# Altium schematic sheet Remote Controller.SchDoc
size B
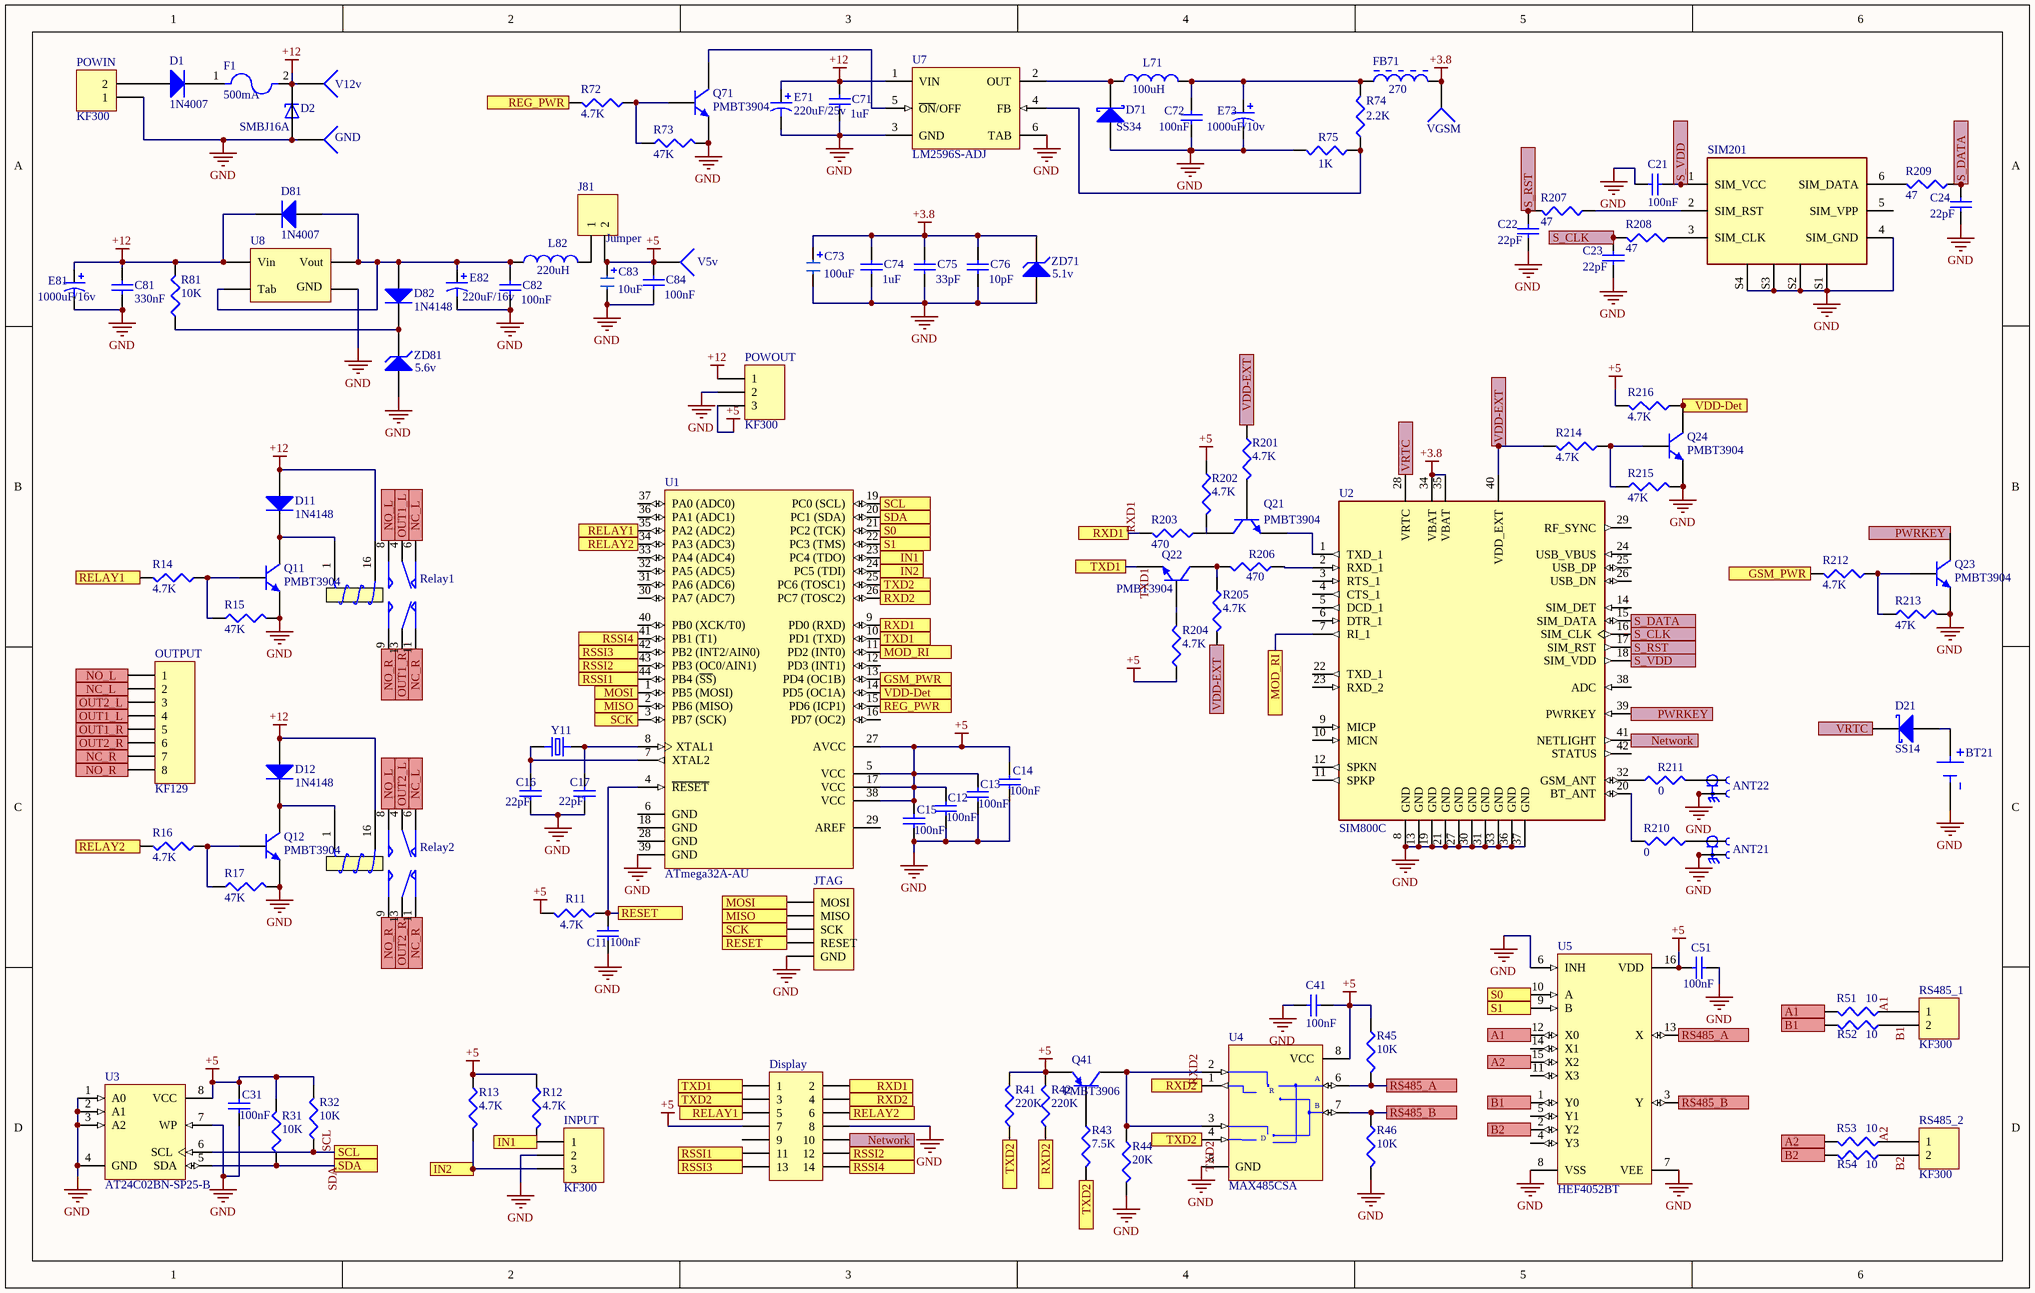
[diagram p0: Remote Controller.SchDoc]

## Parts
ANT21  PIFA_ANTENNA  [PIFA_CONNECTOR]  (value not drawn)
ANT22  SMA_CONNECTOR  [LPRS_SMA_CONNECTOR]  (value not drawn)
BT21  BH32T-C  [BAT_BH32T-C]  (value not drawn)
C11  value 100nF  [C0805]  (hidden comment: Cap)
C12  value 100nF  [C0805]  (hidden comment: Cap)
C13  value 100nF  [C0805]  (hidden comment: Cap)
C14  value 100nF  [C0805]  (hidden comment: Cap)
C15  value 100nF  [C0805]  (hidden comment: Cap)
C16  value 22pF  [C0805]  (hidden comment: Cap)
C17  value 22pF  [C0805]  (hidden comment: Cap)
C21  value 100nF  [C0805]  (hidden comment: Cap)
C22  value 22pF  [C0805]  (hidden comment: Cap)
C23  value 22pF  [C0805]  (hidden comment: Cap)
C24  value 22pF  [C0805]  (hidden comment: Cap)
C31  value 100nF  [C0805]  (hidden comment: Cap)
C41  value 100nF  [C0805]  (hidden comment: Cap)
C51  value 100nF  [C0805]  (hidden comment: Cap)
C71  value 1uF  [C1206]  (hidden comment: Cap)
C72  value 100nF  [C0805]  (hidden comment: Cap)
C73  value 100uF  [Tantalium CASE B]  (hidden comment: Tantalium Cap)
C74  value 1uF  [C1206]  (hidden comment: Cap)
C75  value 33pF  [C0805]  (hidden comment: Cap)
C76  value 10pF  [C0805]  (hidden comment: Cap)
C81  value 330nF  [C0805]  (hidden comment: Cap)
C82  value 100nF  [C0805]  (hidden comment: Cap)
C83  value 10uF  [Tantalium CASE A]  (hidden comment: Tantalium Cap)
C84  value 100nF  [C0805]  (hidden comment: Cap)
D1  1N4007  [DO-214AC(SMA)]
D2  SMBJ16A  [DIOM4336X265N]
D11  1N4148  [Mini MELF]
D12  1N4148  [Mini MELF]
D21  SS14  [DO-214AC(SMA)]
D71  SS34  [DO-214AC(SMA)]
D81  1N4007  [DO-214AC(SMA)]
D82  1N4148  [Mini MELF]
Display  Header 7X2  [HDR2X7]  (value not drawn)
E71  value 220uF/25v  [E]  (hidden comment: 94SS227X06R3EBP)
E73  value 1000uF/10v  [E]  (hidden comment: 94SA107X0016EBP)
E81  value 1000uF/16v  [E]  (hidden comment: 94SA107X0016EBP)
E82  value 220uF/16v  [D]  (hidden comment: 94SC226X0016DBP)
F1  value 500mA  [FUSE SMD 2410]  (hidden comment: Fuse SMD)
FB71  value 270  [AXIAL-0.3]  (hidden comment: Ferrite Bead)
GND  Socket  [PIN1]  (value not drawn)
INPUT  KF300  [HDR1X3]
J81  Jumper  [HDR1X2]
JTAG  Right Female Header 5-Pin  [HDR1X5]  (value not drawn)
L71  value 100uH  [IND POWER RH74]  (hidden comment: Inductor)
L82  value 220uH  [IND POWER CD54]  (hidden comment: Inductor)
OUTPUT  KF129  [HDR1X8]
POWIN  KF300  [HDR1X2]
POWOUT  KF300  [HDR1X3]
Q11  PMBT3904  [SOT-23A_N]
Q12  PMBT3904  [SOT-23A_N]
Q21  PMBT3904  [SOT-23A_N]
Q22  PMBT3904  [SOT-23A_N]
Q23  PMBT3904  [SOT-23A_N]
Q24  PMBT3904  [SOT-23A_N]
Q41  PMBT3906  [SOT-23A_N]
Q71  PMBT3904  [SOT-23A_N]
R11  value 4.7K  [R0805]  (hidden comment: Res)
R12  value 4.7K  [R0805]  (hidden comment: Res)
R13  value 4.7K  [R0805]  (hidden comment: Res)
R14  value 4.7K  [R0805]  (hidden comment: Res)
R15  value 47K  [R0805]  (hidden comment: Res)
R16  value 4.7K  [R0805]  (hidden comment: Res)
R17  value 47K  [R0805]  (hidden comment: Res)
R31  value 10K  [R0805]  (hidden comment: Res)
R32  value 10K  [R0805]  (hidden comment: Res)
R41  value 220K  [R0805]  (hidden comment: Res)
R42  value 220K  [R0805]  (hidden comment: Res)
R43  value 7.5K  [R0805]  (hidden comment: Res)
R44  value 20K  [R0805]  (hidden comment: Res)
R45  value 10K  [R0805]  (hidden comment: Res)
R46  value 10K  [R0805]  (hidden comment: Res)
R51  value 10  [R0805]  (hidden comment: Res)
R52  value 10  [R0805]  (hidden comment: Res)
R53  value 10  [R0805]  (hidden comment: Res)
R54  value 10  [R0805]  (hidden comment: Res)
R72  value 4.7K  [R0805]  (hidden comment: Res)
R73  value 47K  [R0805]  (hidden comment: Res)
R74  value 2.2K  [R0805]  (hidden comment: Res)
R75  value 1K  [R0805]  (hidden comment: Res)
R81  value 10K  [R0805]  (hidden comment: Res)
R201  value 4.7K  [R0805]  (hidden comment: Res)
R202  value 4.7K  [R0805]  (hidden comment: Res)
R203  value 470  [R0805]  (hidden comment: Res)
R204  value 4.7K  [R0805]  (hidden comment: Res)
R205  value 4.7K  [R0805]  (hidden comment: Res)
R206  value 470  [R0805]  (hidden comment: Res)
R207  value 47  [R0805]  (hidden comment: Res)
R208  value 47  [R0805]  (hidden comment: Res)
R209  value 47  [R0805]  (hidden comment: Res)
R210  value 0  [R0805]  (hidden comment: Res)
R211  value 0  [R0805]  (hidden comment: Res)
R212  value 4.7K  [R0805]  (hidden comment: Res)
R213  value 47K  [R0805]  (hidden comment: Res)
R214  value 4.7K  [R0805]  (hidden comment: Res)
R215  value 47K  [R0805]  (hidden comment: Res)
R216  value 4.7K  [R0805]  (hidden comment: Res)
Relay1  2C Relay 12V  [Relay v23105-a5001-a201]  (value not drawn)
Relay2  2C Relay 12V  [Relay v23105-a5001-a201]  (value not drawn)
RS485_1  KF300  [HDR1X2]
RS485_2  KF300  [HDR1X2]
SIM201  SIM Card Holder 6PIN  [SIM Card Holder]  (value not drawn)
U1  ATmega32A-AU  [44A_N]
U2  SIM800C  [LCC110P1570X1760X250-42N]
U3  AT24C02BN-SP25-B  [8S1_N]
U4  MAX485CSA  [NSO8_N]
U5  HEF4052BT  [751B-05_N]
U7  LM2596S-ADJ  [TS5B_N]
U8  Volt Reg  [SOT223_N]  (value not drawn)
V5v  Socket  [PIN1]  (value not drawn)
V12v  Socket  [PIN1]  (value not drawn)
VGSM  Socket  [PIN1]  (value not drawn)
Y11  Crystal Oscillator  [XTAL THD]  (value not drawn)
ZD71  value 5.1v  [Mini MELF]  (hidden comment: Diode Zener)
ZD81  value 5.6v  [Mini MELF]  (hidden comment: Diode Zener)

## Ports
A1, A2, B1, B2, GSM_PWR, IN1, IN2, MISO, MOD_RI, MOSI, NC_L, NC_R, Network, NO_L, NO_R, OUT1_L, OUT1_R, OUT2_L, OUT2_R, PWRKEY, REG_PWR, RELAY1, RELAY2, RESET, RS485_A, RS485_B, RSSI1, RSSI2, RSSI3, RSSI4, RXD1, RXD2, S0, S1, S_CLK, S_DATA, S_RST, S_VDD, SCK, SCL, SDA, TXD1, TXD2, VDD-Det, VDD-EXT, VRTC

## Nets
+3.8: C73.1 C74.2 C75.2 C76.2 FB71.2 U2.34(VBAT) U2.35(VBAT) VGSM.1 ZD71.2(K)
+5: C12.1 C13.1 C14.1 C15.1 C31.1 C41.2 C51.1 C83.1 C84.2 Display.7 J81.2 POWOUT.3 Q41.2(E) R11.2 R12.1 R13.1 R31.2 R32.2 R41.2 R42.2 R45.1 R202.1 R204.1 R216.2 U1.5(VCC) U1.17(VCC) U1.27(AVCC) U1.38(VCC) U3.8(VCC) U4.8(VCC) U5.16(VDD) V5v.1
+12: C71.2 C81.2 D2.C D11.1(A) D12.1(A) D81.2(K) E71.1 E81.1 F1.2 POWOUT.1 R81.2 Relay1.16(T1) Relay2.16(T1) U7.1(VIN) U8.3(Vin) V12v.1
GND: ANT21.G1 ANT21.G2 ANT22.G1 ANT22.G2 ANT22.G3 ANT22.G4 BT21.NEG C11.2 C12.2 C13.2 C14.2 C15.2 C16.2 C17.2 C21.2 C22.2 C23.2 C24.2 C31.2 C41.1 C51.2 C71.1 C72.1 C73.2 C74.1 C75.1 C76.1 C81.1 C82.1 C83.2 C84.1 D2.A D71.1(A) Display.8 E71.2 E73.2 E81.2 E82.2 GND.1 INPUT.2 JTAG.5(GND) POWIN.1 POWOUT.2 Q11.2(E) Q12.2(E) Q23.2(E) Q24.2(E) Q71.2(E) R15.2 R17.2 R44.2 R46.2 R73.2 R75.2 R213.2 R215.2 SIM201.4(SIM_GND) SIM201.S1 SIM201.S2 SIM201.S3 SIM201.S4 U1.39(GND) U2.8(GND) U2.13(GND) U2.19(GND) U2.21(GND) U2.27(GND) U2.30(GND) U2.31(GND) U2.33(GND) U2.36(GND) U2.37(GND) U3.1(A0) U3.2(A1) U3.3(A2) U3.4(GND) U3.7(WP) U4.5(GND) U5.6(INH) U5.7(VEE) U5.8(VSS) U7.3(GND) U7.6(TAB) U8.1(GND) ZD71.1(A) ZD81.1(A)
A1: R51.2 U5.12(X0) ; port A1
A1: R51.1 RS485_1.1  [a separate net that carries the same name]
A2: R53.2 U5.15(X2) ; port A2
A2: R53.1 RS485_2.1  [a separate net that carries the same name]
B1: R52.2 U5.1(Y0) ; port B1
B1: R52.1 RS485_1.2  [a separate net that carries the same name]
B2: R54.2 U5.2(Y2) ; port B2
B2: R54.1 RS485_2.2  [a separate net that carries the same name]
GSM_PWR: R212.2 U1.13(PD4_(OC1B)) ; port GSM_PWR
IN1: INPUT.1 R12.2 U1.23(PC4_(TDO)) ; port IN1
IN2: INPUT.3 R13.2 U1.24(PC5_(TDI)) ; port IN2
MISO: JTAG.2(MISO) U1.2(PB6_(MISO)) ; port MISO
MOD_RI: U1.11(PD2_(INT0)) U2.7(RI_1) ; port MOD_RI
MOSI: JTAG.1(MOSI) U1.1(PB5_(MOSI)) ; port MOSI
NC_L: OUTPUT.2 Relay1.6(NC) Relay2.6(NC) ; port NC_L
NC_R: OUTPUT.7 Relay1.11(NC) Relay2.11(NC) ; port NC_R
Network: Display.10 U2.41(NETLIGHT) ; port Network
NO_L: OUTPUT.1 Relay1.8(NO) Relay2.8(NO) ; port NO_L
NO_R: OUTPUT.8 Relay1.9(NO) Relay2.9(NO) ; port NO_R
OUT1_L: OUTPUT.4 Relay1.4(COM) ; port OUT1_L
OUT1_R: OUTPUT.5 Relay1.13(COM) ; port OUT1_R
OUT2_L: OUTPUT.3 Relay2.4(COM) ; port OUT2_L
OUT2_R: OUTPUT.6 Relay2.13(COM) ; port OUT2_R
PWRKEY: Q23.3(C) U2.39(PWRKEY) ; port PWRKEY
REG_PWR: R72.2 U1.15(PD6_(ICP1)) ; port REG_PWR
RELAY1: Display.5 R14.2 U1.35(PA2_(ADC2)) ; port RELAY1
RELAY2: Display.6 R16.2 U1.34(PA3_(ADC3)) ; port RELAY2
RESET: C11.1 JTAG.4(RESET) R11.1 U1.4(~{RESET}) ; port RESET
RS485_A: R45.2 U4.6(A) U5.13(X) ; port RS485_A
RS485_B: R46.1 U4.7(B) U5.3(Y) ; port RS485_B
RSSI1: Display.11 U1.44(PB4_(~{SS})) ; port RSSI1
RSSI2: Display.12 U1.43(PB3_(OC0/AIN1)) ; port RSSI2
RSSI3: Display.13 U1.42(PB2_(INT2/AIN0)) ; port RSSI3
RSSI4: Display.14 U1.41(PB1_(T1)) ; port RSSI4
RXD1: Display.2 R203.2 U1.9(PD0_(RXD)) ; port RXD1
RXD2: Display.4 R42.1 U1.26(PC7_(TOSC2)) U4.1(RO) ; port RXD2
S0: U1.21(PC2_(TCK)) U5.10(A) ; port S0
S1: U1.22(PC3_(TMS)) U5.9(B) ; port S1
S_CLK: C23.1 R208.2 U2.16(SIM_CLK) ; port S_CLK
S_DATA: C24.1 R209.1 U2.15(SIM_DATA) ; port S_DATA
S_RST: C22.1 R207.2 U2.17(SIM_RST) ; port S_RST
S_VDD: C21.1 SIM201.1(SIM_VCC) U2.18(SIM_VDD) ; port S_VDD
SCK: JTAG.3(SCK) U1.3(PB7_(SCK)) ; port SCK
SCL: R32.1 U1.19(PC0_(SCL)) U3.6(SCL) ; port SCL
SDA: R31.1 U1.20(PC1_(SDA)) U3.5(SDA) ; port SDA
TXD1: Display.1 Q22.2(E) U1.10(PD1_(TXD)) ; port TXD1
TXD2: Display.3 R41.1 R43.2 U1.25(PC6_(TOSC1)) U4.4(DI) ; port TXD2
VDD-Det: Q24.3(C) R216.1 U1.14(PD5_(OC1A)) ; port VDD-Det
VDD-EXT: R201.1 R205.2 R214.2 U2.40(VDD_EXT) ; port VDD-EXT
VRTC: D21.2(K) U2.28(VRTC) ; port VRTC
NetANT21_1: ANT21.1 R210.1
NetANT22_1: ANT22.1 R211.2
NetBT21_POS: BT21.POS D21.1(A)
NetC16_1: C16.1 U1.7(XTAL2) Y11.1
NetC17_1: C17.1 U1.8(XTAL1) Y11.2
NetC72_2: C72.2 E73.1 FB71.1 L71.2 R74.2
NetC82_2: C82.2 D81.1(A) D82.1(A) E82.1 L82.1 U8.2(Vout) U8.4(Tab)
NetD1_1: D1.1(A) POWIN.2
NetD1_2: D1.2(K) F1.1
NetD11_2: D11.2(K) Q11.3(C) Relay1.1(T2)
NetD12_2: D12.2(K) Q12.3(C) Relay2.1(T2)
NetD71_2: D71.2(K) L71.1 U7.2(OUT)
NetD82_2: D82.2(K) R81.1 ZD81.2(K)
NetJ81_1: J81.1 L82.2
NetQ11_1: Q11.1(B) R14.1 R15.1
NetQ12_1: Q12.1(B) R16.1 R17.1
NetQ21_1: Q21.1(B) R201.2
NetQ21_2: Q21.2(E) U2.1(TXD_1)
NetQ21_3: Q21.3(C) R202.2 R203.1
NetQ22_1: Q22.1(B) R204.2
NetQ22_3: Q22.3(C) R205.1 R206.2
NetQ23_1: Q23.1(B) R212.1 R213.1
NetQ24_1: Q24.1(B) R214.1 R215.1
NetQ41_1: Q41.1(B) R43.1
NetQ41_3: Q41.3(C) R44.1 U4.2(~{RE}) U4.3(DE)
NetQ71_1: Q71.1(B) R72.1 R73.1
NetQ71_3: Q71.3(C) U7.5(~{ON}/OFF)
NetR74_1: R74.1 R75.1 U7.4(FB)
NetR206_1: R206.1 U2.2(RXD_1)
NetR207_1: R207.1 SIM201.2(SIM_RST)
NetR208_1: R208.1 SIM201.3(SIM_CLK)
NetR209_2: R209.2 SIM201.6(SIM_DATA)
NetR210_2: R210.2 U2.20(BT_ANT)
NetR211_1: R211.1 U2.32(GSM_ANT)

Not connected (* = marked no-connect by the designer): Display 9; SIM201 5(SIM_VPP); U1 6(GND) 12(PD3_(INT1)) 16(PD7_(OC2)) 18(GND) 28(GND) 29(AREF) 30(PA7_(ADC7)) 31(PA6_(ADC6)) 32(PA5_(ADC5)) 33(PA4_(ADC4)) 36(PA1_(ADC1)) 37(PA0_(ADC0)) 40(PB0_(XCK/T0)); U2 3(RTS_1) 4(CTS_1) 5(DCD_1) 6(DTR_1) 9(MICP) 10(MICN) 11(SPKP) 12(SPKN) 14(SIM_DET) 22(TXD_1) 23(RXD_2) 24(USB_VBUS) 25(USB_DP) 26(USB_DN) 29(RF_SYNC) 38(ADC) 42(STATUS); U5 4(Y3) 5(Y1) 11(X3) 14(X1)

## Notes on the sheet
- (in symbol MAX485CSA) R; D

## Library data of the parts
ANT21 = PIFA_ANTENNA: RF Connectors / Printed and Surface-mount Antenna; MP: SMA CONNECTOR; MF: LPRS; Check_prices: https://www.snapeda.com/parts/SMA%20CONNECTOR/LPRS/view-part/?ref=eda; Value: *; Availability: In Stock; Price: None; Package: None; SnapEDA_Link: https://www.snapeda.com/parts/SMA%20CONNECTOR/LPRS/view-part/?ref=snap; Purchase-URL: https://pricing.snapeda.com/search/part/SMA CONNECTOR/?ref=eda
ANT22 = SMA_CONNECTOR: RF Connectors / Coaxial Connectors SMA Coaxial Right angled; MP: SMA CONNECTOR; MF: LPRS; Check_prices: https://www.snapeda.com/parts/SMA%20CONNECTOR/LPRS/view-part/?ref=eda; Value: *; Availability: In Stock; Price: None; Package: None; SnapEDA_Link: https://www.snapeda.com/parts/SMA%20CONNECTOR/LPRS/view-part/?ref=snap; Purchase-URL: https://pricing.snapeda.com/search/part/SMA CONNECTOR/?ref=eda
BT21 = BH32T-C: BATTERY HOLDER COIN 20MM PC PIN; MF: MPD; SnapEDA_Link: https://www.snapeda.com/parts/BH32T-C/Memory+Protection+Devices/view-part/?ref=snap; Package: None; MP: BH32T-C; Check_prices: https://www.snapeda.com/parts/BH32T-C/Memory+Protection+Devices/view-part/?ref=eda; Purchase-URL: https://pricing.snapeda.com/search/part/BH32T-C/?ref=eda; Price: None; Value: *; Availability: In Stock
C11-C17 C21-C24 C31 C41 C51 C71 C72 C74-C76 C81 C82 C84 = Cap: Capacitor
C73 C83 = Cap Pol2: Polarized Capacitor Tantalium
D1 D81 = Diode: Default Diode; Published: 8-Jun-2000; LatestRevisionDate: 17-Jul-2002; LatestRevisionNote: Re-released for DXP Platform.; PackageVersion: Sep-1996; PackageReference: SMC; Publisher: Altium Limited; PackageDescription: DO-214-AB/SMC; 2 C-Bend Leads; Body 7.9 x 5.9 mm, inc. leads (LxW); Code_JEDEC: DO-214-AB; value: 1N4007
D2 = SMBJ12A: 15.6V Clamp 17.5A Ipp Tvs Diode Surface Mount DO-214AA (SMB); MF: ON Semiconductor; Purchase-URL: https://pricing.snapeda.com/search/part/SMBJ12A/?ref=eda; MP: SMBJ12A; SnapEDA_Link: https://www.snapeda.com/parts/SMBJ12A/Onsemi/view-part/?ref=snap; Price: None; Package: SMB-2 Fairchild Semiconductor; Check_prices: https://www.snapeda.com/parts/SMBJ12A/Onsemi/view-part/?ref=eda; Value: *; Availability: In Stock
D11 D12 D82 = Diode 1N4148: High Conductance Fast Diode; PackageDescription: Diode
D21 = 1N6095: Schottky Rectifier; Note: No PCB Footprint Available; Published: 8-Jun-2000; LatestRevisionDate: 17-Jul-2002; LatestRevisionNote: Re-released for DXP Platform.; DatasheetVersion: Dec-1997; PackageReference: DO-203AA; Publisher: Altium Limited; ComponentLink1Description: Manufacturer Link; ComponentLink1URL: http://www.irf.com/; ComponentLink2Description: Datasheet; ComponentLink2URL: http://www.irf.com/product-info/datasheets/data/1n6096.pdf; value: SS14
D71 = SS36: Schottky Rectifier; PackageDescription: DO-214-AB/SMC; 2 C-Bend Leads; Body 7.9 x 5.9 mm, inc. leads (LxW); value: SS34
Display = Header 7X2: Header, 7-Pin, Dual row; value: IDC Box; LatestRevisionDate: 17-Jul-2002; LatestRevisionNote: Re-released for DXP Platform.; Publisher: Altium Limited
E71 = 94SS227X06R3EBP: Solid Aluminum Capacitor with Organic Semiconductor Electrolyte: 220uF, 6.3V, Bulk Pack; Note: Part Numbers shown are for ± 20% capacitance tolerance (X0).; PCB_Layout: Complies with Manufacturer's Recommendation.; DrillSize: Nominal, Rounded to the nearest 0.1mm; Published: 19-Mar-2004; DatasheetDocument: 23-May-2001; PackageReference: E; Publisher: Altium Limited; ComponentLink1Description: Manufacturer Link; ComponentLink1URL: http://www.vishay.com/; ComponentLink2Description: Datasheet; ComponentLink2URL: http://www.vishay.com/docs/90008/94ss.pdf
E73 E81 = 94SA107X0016EBP: Solid Aluminum Capacitor with Organic Semiconductor Electrolyte: 100uF, 16V, Bulk Pack; Note: Part Numbers shown are for ± 20% capacitance tolerance (X0).; PCB_Layout: Complies with Manufacturer's Recommendation.; DrillSize: Nominal, Rounded to the nearest 0.1mm; Published: 19-Mar-2004; DatasheetDocument: 29-Jun-2001; PackageReference: E; Publisher: Altium Limited; ComponentLink1Description: Manufacturer Link; ComponentLink1URL: http://www.vishay.com/; ComponentLink2Description: Datasheet; ComponentLink2URL: http://www.vishay.com/docs/90003/94sa.pdf
E82 = 94SC226X0016DBP: Solid Aluminum Capacitor with Organic Semiconductor Electrolyte: 22uF, 16V, Bulk Pack; Note: Part Numbers shown are for ± 20% capacitance tolerance (X0).; PCB_Layout: Complies with Manufacturer's Recommendation.; DrillSize: Nominal, Rounded to the nearest 0.1mm; Published: 19-Mar-2004; DatasheetDocument: 23-May-2001; PackageReference: D; Publisher: Altium Limited; ComponentLink1Description: Manufacturer Link; ComponentLink1URL: http://www.vishay.com/; ComponentLink2Description: Datasheet; ComponentLink2URL: http://www.vishay.com/docs/90004/94sc.pdf
F1 = Fuse SMD: 2410 SMT Fuse | Quick Acting | 1A; MF: Bel Fuse; MP: 0679L1000-05; SnapEDA_Link: https://www.snapeda.com/parts/0679L1000-05/Bel%20Fuse/view-part/1313867/?ref=snap; Availability: Warning; Price: None; Package: SMD-2 Bel Fuse; Purchase-URL: https://pricing.snapeda.com/search/part/0679L1000-05/?ref=eda
INPUT POWOUT = Header 3: Header, 3-Pin; value: KF300-3P; LatestRevisionDate: 17-Jul-2002; LatestRevisionNote: Re-released for DXP Platform.; Publisher: Altium Limited
J81 = Header 2: Header, 2-Pin; LatestRevisionDate: 17-Jul-2002; LatestRevisionNote: Re-released for DXP Platform.; Publisher: Altium Limited
JTAG = Header 5: Header, 5-Pin; LatestRevisionDate: 17-Jul-2002; LatestRevisionNote: Re-released for DXP Platform.; Publisher: Altium Limited
L71 L82 = Inductor: Inductor SMD; PackageDescription: Inductor
OUTPUT = Header 8: Header, 8-Pin; LatestRevisionDate: 17-Jul-2002; LatestRevisionNote: Re-released for DXP Platform.; Publisher: Altium Limited; value: KF129
POWIN RS485_1 RS485_2 = Header 2: Header, 2-Pin; value: KF300-2P; LatestRevisionDate: 17-Jul-2002; LatestRevisionNote: Re-released for DXP Platform.; Publisher: Altium Limited
Q11 Q12 Q21-Q24 Q71 = BC817-25: NPN General Purpose Amplifier; Published: 8-Jun-2000; LatestRevisionDate: 20-Nov-2009; LatestRevisionNote: IPC-7351 Footprint Added.; DatasheetVersion: 1997; PackageVersion: Sep-1998; PackageReference: SOT-23A; Publisher: Altium Limited; PackageDescription: 3-Pin SOT-23 Package 0.95 mm Pitch, 2.3 mm Lead Span; ComponentLink1Description: Manufacturer Link; ComponentLink1URL: http://www.fairchildsemi.com/; ComponentLink2Description: Discontinuation Notice; ComponentLink2URL: http://www.fairchildsemi.com/obsolete/obs.jsp
Q41 = BC807-25: PNP General Purpose Amplifier; Published: 8-Jun-2000; LatestRevisionDate: 20-Nov-2009; LatestRevisionNote: IPC-7351 Footprint Added.; DatasheetVersion: 1997; PackageVersion: Sep-1998; PackageReference: SOT-23A; Publisher: Altium Limited; PackageDescription: 3-Pin SOT-23 Package 0.95 mm Pitch, 2.3 mm Lead Span; ComponentLink1Description: Manufacturer Link; ComponentLink1URL: http://www.fairchildsemi.com/; ComponentLink2Description: Datasheet; ComponentLink2URL: http://www.fairchildsemi.com/ds/BC%2FBC807.pdf
R11-R17 R31 R32 R41-R46 R51-R54 R72-R75 R81 R201-R216 = Res: Resistor; PackageDescription: Chip Resistor
Relay1 Relay2 = Relay-8Pin: 2C Telecommunication Relay
SIM201 = SIM Card Holder 6PIN: 6 Position Card Connector SIM Card Surface Mount, Right Angle Gold; MP: 693010020611; MF: Wurth Electronics; Price: None; SnapEDA_Link: https://www.snapeda.com/parts/693010020611/Wurth%20Electronics%20Inc./view-part/514470/?ref=snap; Package: None; Value: *; Availability: Unavailable
U1 = ATmega32A-AU: 8-bit AVR Microcontroller, 2.7-5.5V, 16MHz, 32KB Flash, 1KB EEPROM, 2KB SRAM, 44-pin TQFP, Industrial Grade (-40°C to 85°C); DatasheetVersion: revC, Feb-2011; PackageVersion: revC, Oct-2010; PackageReference: 44A; PackageDescription: 44-Pin Plastic Thin Profile Quad Flat Pack, 10 x 10 x 1.0 mm Body, 0.8 mm Pitch (TQFP); Code_JEDEC: MS-026-ACB; ComponentLink1Description: Manufacturer URL; ComponentLink1URL: http://www.atmel.com/; ComponentLink2Description: ATmega32A Datasheet; ComponentLink2URL: http://www.atmel.com/dyn/resources/prod_documents/doc8155.pdf; ComponentLink3Description: ATmega32A Summary; ComponentLink3URL: http://www.atmel.com/dyn/resources/prod_documents/8155S.pdf
U2 = SIM800C: Module: GSM/Bluetooth; GPRS; 2G; 1800MHz, 900MHz; 85.6kbps; SMD; MF: Simcom; MP: SIM800C; Availability: Unavailable; Package: None; Value: *; Price: None; SnapEDA_Link: https://www.snapeda.com/parts/SIM800C/SIMcom%20Wireless%20solutions%20Co.%2CLtd/view-part/571323/?ref=snap
U3 = AT24C02BN-SP25-B: 2Kbit (256 x 8), 2-wire Bus Automotive Serial EEPROM with full memory Write Protect, 2.5V, 8-Pin SOIC, Bulk; Published: 20-Sep-2010; DatasheetVersion: 8517C,  Jan-2009; PackageVersion: revC, Mar-2005; PackageReference: 8S1; Publisher: Altium Limited; PackageDescription: 8-Lead (0.150" Wide Body), Plastic Gull Wing Small Outline (JEDEC SOIC); Code_JEDEC: MS-012-AA; Code_IPC: SOIC127P600-8; ComponentLink1Description: Manufacturer Link; ComponentLink1URL: http://www.atmel.com/products/serial/default.asp; ComponentLink2Description: Datasheet; ComponentLink2URL: http://www.atmel.com/dyn/resources/prod_documents/doc8517.pdf; ComponentLink3Description: Atmel.com Home; ComponentLink3URL: http://www.atmel.com
U4 = MAX485CSA: Low-Power, Slew-Rate-Limited RS-485/RS-422 Transceiver; Published: 16-Jan-2001; LatestRevisionDate: 13-Apr-2006; LatestRevisionNote: IPC-7351 Footprint Added.; DatasheetVersion: Feb-1996; PackageReference: NSO8; Publisher: Altium Limited; PackageDescription: 8-Pin Small Outline Integrated Circuit 1.27 mm Pitch; Code_JEDEC: MS-012-AA; Code_IPC: SOIC127P600-8; ComponentLink1Description: Manufacturer Link; ComponentLink1URL: http://www.maxim-ic.com/; ComponentLink2Description: Datasheet; ComponentLink2URL: http://pdfserv.maxim-ic.com/en/ds/MAX1487-MAX491.pdf
U5 = MC14052BD: Dual 4-Channel Analog Multiplexer/Demultiplexer; Published: 15-Apr-2002; LatestRevisionDate: 13-Apr-2006; LatestRevisionNote: IPC-7351 Footprint Added.; DatasheetVersion: 1995; PackageVersion: Oct-1999; PackageReference: 751B-05; Publisher: Altium Limited; PackageDescription: 16-Pin Small Outline Integrated Circuit 1.27 mm Pitch; Code_JEDEC: MS-012-AC; Code_IPC: SOIC127P600-16; ComponentLink1Description: Manufacturer Link; ComponentLink1URL: http://www.onsemi.com/; ComponentLink2Description: Datasheet; ComponentLink2URL: http://www.onsemi.com/pub/Collateral/MC14051B-D.PDF
U7 = LM2596S-ADJ: SIMPLE SWITCHER® Power Converter 150 KHz 3A Step-Down Voltage Regulator, 5-pin TO-263; PackageDescription: TO-263, Molded, .400 x .390 x .180in, 5 Lead, .067in Pitch, Surface Mount; PartNumber: LM2596S-ADJ; PinCount: 5
U8 = Volt Reg: SMD Voltage Regulator; PackageDescription: Molded SOT-223, 6.50 x 3.56 x 1.6mm Body, 4 Lead, 2.3mm Pitch
Y11 = Crystal Oscillator: 10MHz ±30ppm Crystal 18pF 60 Ohms; MF: ECS Inc.; MP: ECS-100-18-4X; value: 11.0592 MHz; Package: HC49/US ECS International; Digi-Key_Part_Number: X1080-ND; SnapEDA_Link: https://www.snapeda.com/parts/ECS-100-18-4X/ECS%20Inc./view-part/583488/?ref=snap
ZD71 ZD81 = Diode Zener: Zener Diode; PackageDescription: Zener Diode
FB71 = Ferrite Bead: PackageDescription: Chip Inductor
GND V5v V12v VGSM = Socket: LatestRevisionDate: 17-Jul-2002; LatestRevisionNote: Re-released for DXP Platform.; Publisher: Altium Limited